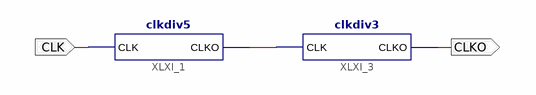
[diagram p0: schematic sheet 1]
// Xilinx ISE schematic compositeTest.sch (spartan6) as structural Verilog: 2 symbols, 2 ports
module compositeTest (
  input  CLK,
  output CLKO
);

  wire XLXN_1;

  clkdiv5 XLXI_1 (.CLK(CLK), .CLKO(XLXN_1));
  clkdiv3 XLXI_3 (.CLK(XLXN_1), .CLKO(CLKO));
endmodule
